# Altium schematic sheet Condor2_CV_Sensors.SchDoc
size A4
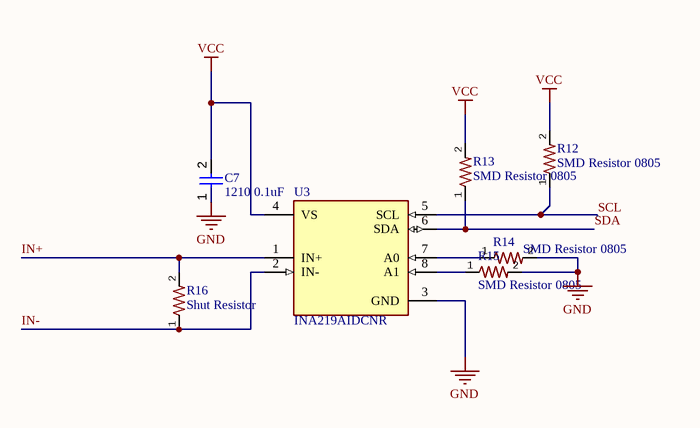
[diagram p0: Condor2_CV_Sensors.SchDoc]

## Parts
C7  1210 0.1uF  [1210]
R12  SMD Resistor 0805  [RES 0805]
R13  SMD Resistor 0805  [RES 0805]
R14  SMD Resistor 0805  [RES 0805]
R15  SMD Resistor 0805  [RES 0805]
R16  Shut Resistor  [PT2512]
U3  INA219AIDCNR  [INA219]

## Nets
GND: C7.1 R14.2 R15.2 U3.3(GND)
VCC: C7.2 R12.2 R13.2 U3.4(VS)
IN+: R16.2 U3.1(IN+)
IN-: R16.1 U3.2(IN-)
SCL: R12.1 U3.5(SCL)
SDA: R13.1 U3.6(SDA)
NetR14_1: R14.1 U3.7(A0)
NetR15_1: R15.1 U3.8(A1)

## Library data of the parts
C7 = Capacitor 1210
R16 = PT2512FK
U3 = INA219: IC CURRENT MONITOR 1% SOT23-8; Common Mode Rejection Ratio: 100dB; Bandwidth: 3.4MHz; Operating Supply Current: 1mA; Nominal Supply Current: 700uA; Min Input Voltage: 0V; Output Current per Channel: 10mA; Number of Amplifiers: 1; Input Offset Voltage (Vos): 100uV; Max Input Voltage: 26V; Min Supply Voltage: 3V; Max Supply Current: 5mA; Max Supply Voltage: 5.5V; Output Type: Digital; Accuracy: 1%; Radiation Hardening: No; Min Operating Temperature: -40°C; Contact Plating: Gold; REACH SVHC: No SVHC; Packaging: Tape and Reel; Max Operating Temperature: 125°C; Lead Free: Lead Free; Weight: 0.001411oz; Supply Current: 700uA; Number of Pins: 8; Length: 3mm; Quiescent Current: 700uA; Features: I²C; Height: 1.3mm; Output Current: 10mA; Case/Package: SOT-23-8; RoHS Compliant: Yes; Width: 1.75mm; Package Quantity: 3000; Series: Zero-Drift